# EAGLE design 104-de-8 (EAGLE 6.6.0)

## Sheet 1 of 2
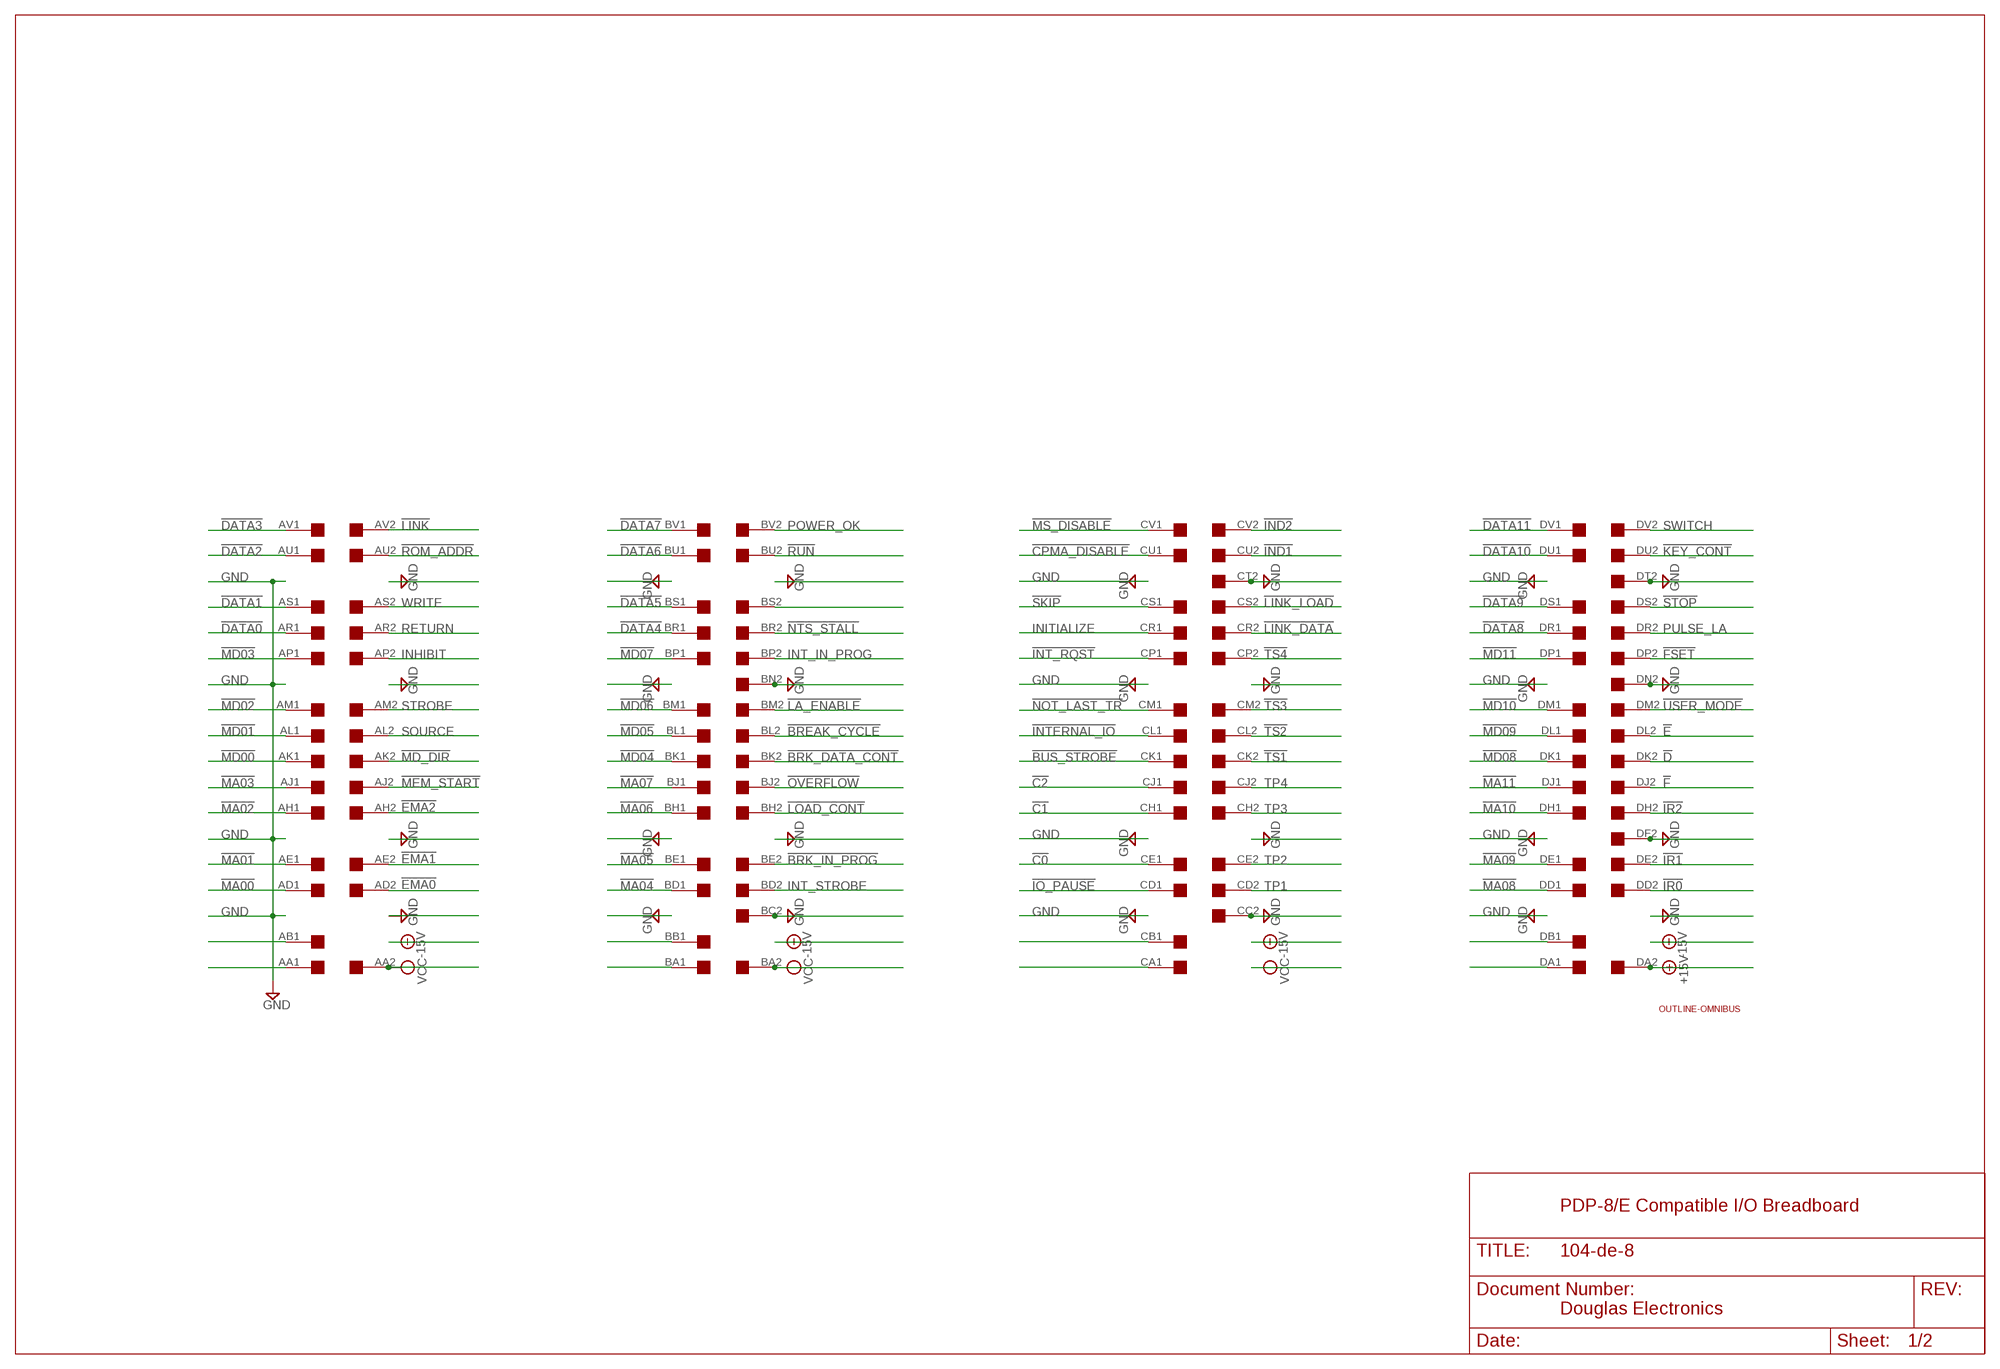
[diagram p0: schematic, sheet 1]

### Parts
U$1  OUTLINE-OMNIBUS  [OMNIBUS]
U$2  QUAD  [EDGE-CON8]

### Nets
!BREAK_CYCLE: U$2.BL2
!BRK_DATA_CONT: U$2.BK2
!BRK_IN_PROG: U$2.BE2
!BUS_STROBE: U$2.CK1
!C0: U$2.CE1
!C1: U$2.CH1
!C2: U$2.CJ1
!CPMA_DISABLE: U$2.CU1
!D: U$2.DK2
!DATA0: U$2.AR1
!DATA1: U$2.AS1
!DATA2: U$2.AU1
!DATA3: U$2.AV1
!DATA4: U$2.BR1
!DATA5: U$2.BS1
!DATA6: U$2.BU1
!DATA7: U$2.BV1
!DATA8: U$2.DR1
!DATA9: U$2.DS1
!DATA10: U$2.DU1
!DATA11: U$2.DV1
!E: U$2.DL2
!EMA0: U$2.AD2 ; also sheet 2
!EMA1: U$2.AE2 ; also sheet 2
!EMA2: U$2.AH2 ; also sheet 2
!F: U$2.DJ2
!FSET: U$2.DP2
!IND1: U$2.CU2
!IND2: U$2.CV2
!INT_RQST: U$2.CP1
!INTERNAL_IO: U$2.CL1
!IO_PAUSE: U$2.CD1
!IR0: U$2.DD2
!IR1: U$2.DE2
!IR2: U$2.DH2
!KEY_CONT: U$2.DU2
!LA_ENABLE: U$2.BM2
!LINK: U$2.AV2
!LINK_DATA: U$2.CR2
!LINK_LOAD: U$2.CS2
!LOAD_CONT: U$2.BH2
!MA00: U$2.AD1 ; also sheet 2
!MA01: U$2.AE1 ; also sheet 2
!MA02: U$2.AH1 ; also sheet 2
!MA03: U$2.AJ1 ; also sheet 2
!MA04: U$2.BD1 ; also sheet 2
!MA05: U$2.BE1 ; also sheet 2
!MA06: U$2.BH1 ; also sheet 2
!MA07: U$2.BJ1 ; also sheet 2
!MA08: U$2.DD1 ; also sheet 2
!MA09: U$2.DE1 ; also sheet 2
!MA10: U$2.DH1 ; also sheet 2
!MA11: U$2.DJ1 ; also sheet 2
!MD00: U$2.AK1
!MD01: U$2.AL1
!MD02: U$2.AM1
!MD03: U$2.AP1
!MD04: U$2.BK1
!MD05: U$2.BL1
!MD06: U$2.BM1
!MD07: U$2.BP1
!MD08: U$2.DK1
!MD09: U$2.DL1
!MD10: U$2.DM1
!MD11: U$2.DP1
!MD_DIR: U$2.AK2 ; also sheet 2
!MEM_START: U$2.AJ2
!MS_DISABLE: U$2.CV1
!NOT_LAST_TR: U$2.CM1
!NTS_STALL: U$2.BR2
!OVERFLOW: U$2.BJ2
!ROM_ADDR: U$2.AU2
!RUN: U$2.BU2
!SKIP: U$2.CS1
!STOP: U$2.DS2
!TS1: U$2.CK2
!TS2: U$2.CL2
!TS3: U$2.CM2
!TS4: U$2.CP2
!USER_MODE: U$2.DM2
+15V: U$2.DA2
GND [supply]: U$2.BC2 U$2.BN2 U$2.CC2 U$2.CT2 U$2.DF2 U$2.DN2 U$2.DT2 ; also sheet 2
INHIBIT: U$2.AP2
INITIALIZE: U$2.CR1
INT_IN_PROG: U$2.BP2
INT_STROBE: U$2.BD2
N$46: U$2.AB1
N$47: U$2.AA1
N$48: U$2.BB1
N$49: U$2.BA1
N$50: U$2.CA1
N$51: U$2.BS2
N$52: U$2.CB1
N$53: U$2.DA1
N$54: U$2.DB1
POWER_OK: U$2.BV2
PULSE_LA: U$2.DR2
RETURN: U$2.AR2
SOURCE: U$2.AL2
STROBE: U$2.AM2
SWITCH: U$2.DV2
TP1: U$2.CD2
TP2: U$2.CE2
TP3: U$2.CH2
TP4: U$2.CJ2
VCC [supply]: U$2.AA2 U$2.BA2 ; also sheet 2
WRITE: U$2.AS2
Unconnected: U$2.AB2 U$2.AC1 U$2.AC2 U$2.AF1 U$2.AF2 U$2.AN1 U$2.AN2 U$2.AT1 U$2.AT2 U$2.BB2 U$2.BC1 U$2.BF1 U$2.BF2 U$2.BN1 U$2.BT1 U$2.BT2 U$2.CA2 U$2.CB2 U$2.CC1 U$2.CF1 U$2.CF2 U$2.CN1 U$2.CN2 U$2.CT1 U$2.DB2 U$2.DC1 U$2.DC2 U$2.DF1 U$2.DN1 U$2.DT1

### Notes on the sheet
- PDP-8/E Compatible I/O Breadboard
- Douglas Electronics

## Sheet 2 of 2
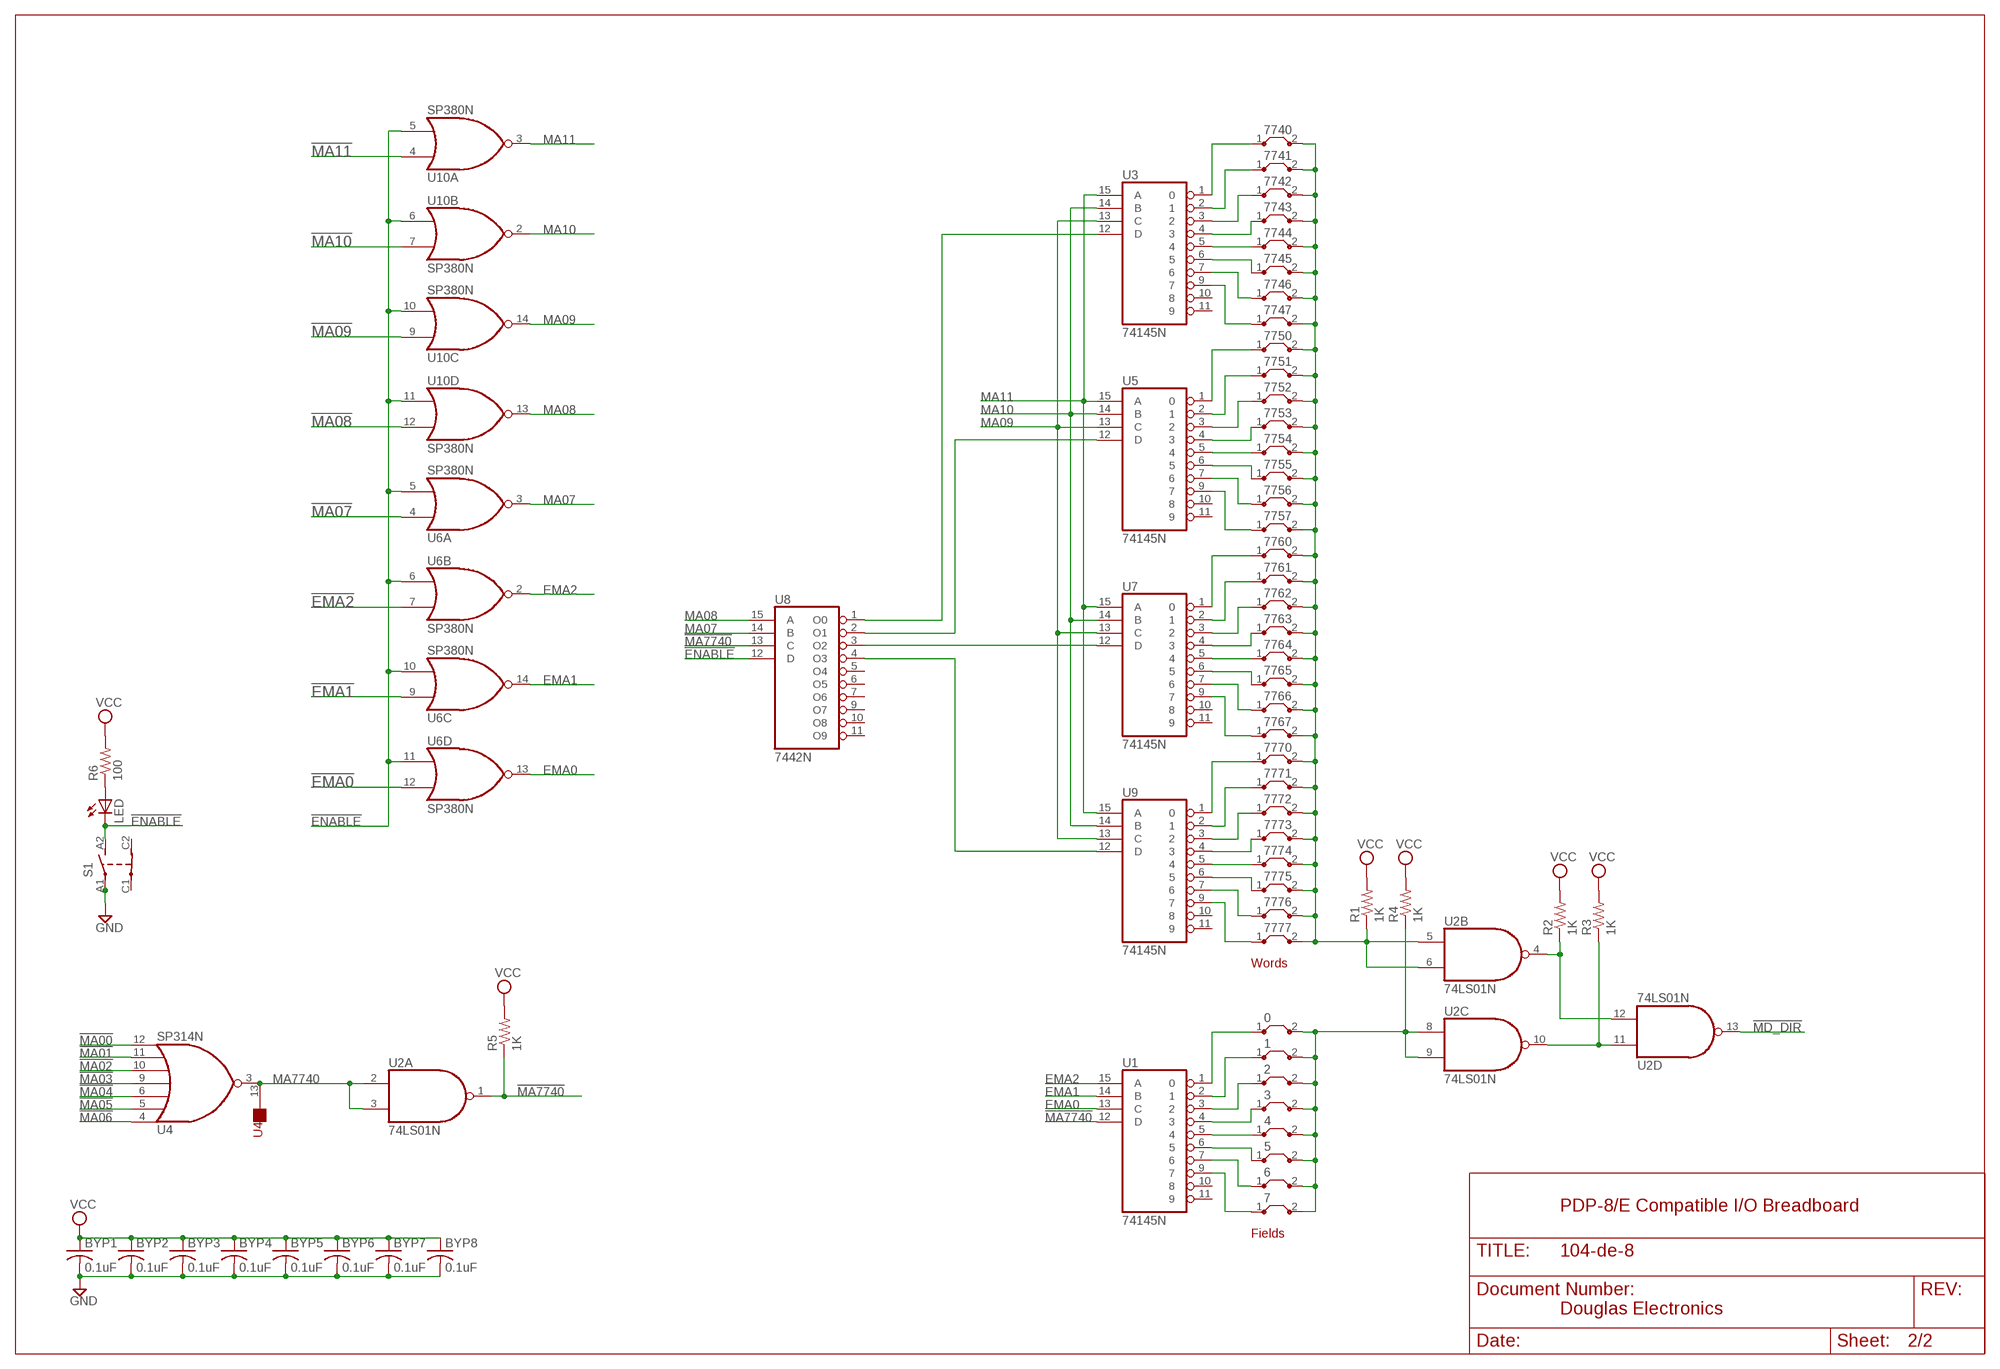
[diagram p1: schematic, sheet 2]

### Parts
0  J5MM  [05]
1  J5MM  [05]
2  J5MM  [05]
3  J5MM  [05]
4  J5MM  [05]
5  J5MM  [05]
6  J5MM  [05]
7  J5MM  [05]
7740  J5MM  [05]
7741  J5MM  [05]
7742  J5MM  [05]
7743  J5MM  [05]
7744  J5MM  [05]
7745  J5MM  [05]
7746  J5MM  [05]
7747  J5MM  [05]
7750  J5MM  [05]
7751  J5MM  [05]
7752  J5MM  [05]
7753  J5MM  [05]
7754  J5MM  [05]
7755  J5MM  [05]
7756  J5MM  [05]
7757  J5MM  [05]
7760  J5MM  [05]
7761  J5MM  [05]
7762  J5MM  [05]
7763  J5MM  [05]
7764  J5MM  [05]
7765  J5MM  [05]
7766  J5MM  [05]
7767  J5MM  [05]
7770  J5MM  [05]
7771  J5MM  [05]
7772  J5MM  [05]
7773  J5MM  [05]
7774  J5MM  [05]
7775  J5MM  [05]
7776  J5MM  [05]
7777  J5MM  [05]
BYP1  0.1uF  C-US  [C063-025X075]
BYP2  0.1uF  C-US  [C063-025X075]
BYP3  0.1uF  C-US  [C063-025X075]
BYP4  0.1uF  C-US  [C063-025X075]
BYP5  0.1uF  C-US  [C063-025X075]
BYP6  0.1uF  C-US  [C063-025X075]
BYP7  0.1uF  C-US  [C063-025X075]
BYP8  0.1uF  C-US  [C063-025X075]
LED  LED5MM  [LED5MM]
R1  1K  R-US_0207/10  [0207/10]
R2  1K  R-US_0207/10  [0207/10]
R3  1K  R-US_0207/10  [0207/10]
R4  1K  R-US_0207/10  [0207/10]
R5  1K  R-US_0207/10  [0207/10]
R6  100  R-US_0207/10  [0207/10]
S1  T8201  [T8000]
U1  74145N  [DIL16]
U2  74LS01N  [DIL14]
U3  74145N  [DIL16]
U4  SP314N  [DIL14]
U5  74145N  [DIL16]
U6  SP380N  [DIL14]
U7  74145N  [DIL16]
U8  7442N  74LS42N  [DIL16]
U9  74145N  [DIL16]
U10  SP380N  [DIL14]

### Nets
!EMA0: U6.12(D:I1) ; also sheet 1
!EMA1: U6.9(C:I0) ; also sheet 1
!EMA2: U6.7(B:I1) ; also sheet 1
!ENABLE: LED.K(C) S1.A2 U6.5(A:I1) U6.6(B:I0) U6.10(C:I1) U6.11(D:I0) U8.12(D) U10.5(A:I1) U10.6(B:I0) U10.10(C:I1) U10.11(D:I0)
!MA00: U4.12(I6) ; also sheet 1
!MA01: U4.11(I5) ; also sheet 1
!MA02: U4.10(I4) ; also sheet 1
!MA03: U4.9(I3) ; also sheet 1
!MA04: U4.6(I2) ; also sheet 1
!MA05: U4.5(I1) ; also sheet 1
!MA06: U4.4(I0) ; also sheet 1
!MA07: U6.4(A:I0) ; also sheet 1
!MA08: U10.12(D:I1) ; also sheet 1
!MA09: U10.9(C:I0) ; also sheet 1
!MA10: U10.7(B:I1) ; also sheet 1
!MA11: U10.4(A:I0) ; also sheet 1
!MA7740: R5.1 U1.12(D) U2.1(A:O) U8.13(C)
!MD_DIR: U2.13(D:O) ; also sheet 1
EMA0: U1.13(C) U6.13(D:O)
EMA1: U1.14(B) U6.14(C:O)
EMA2: U1.15(A) U6.2(B:O)
GND [supply]: BYP1.2 BYP2.2 BYP3.2 BYP4.2 BYP5.2 BYP6.2 BYP7.2 BYP8.2 S1.A1 ; also sheet 1
MA07: U6.3(A:O) U8.14(B)
MA08: U8.15(A) U10.13(D:O)
MA09: U3.13(C) U5.13(C) U7.13(C) U9.13(C) U10.14(C:O)
MA10: U3.14(B) U5.14(B) U7.14(B) U9.14(B) U10.2(B:O)
MA11: U3.15(A) U5.15(A) U7.15(A) U9.15(A) U10.3(A:O)
MA7740: U2.2(A:I0) U2.3(A:I1) U4.3(O) U4.13(NC)
N$2: LED.A R6.1
N$3: U8.4(O3) U9.12(D)
N$4: U5.12(D) U8.2(O1)
N$7: U7.12(D) U8.3(O2)
N$8: U3.12(D) U8.1(O0)
N$33: 7740.2 7741.2 7742.2 7743.2 7744.2 7745.2 7746.2 7747.2 7750.2 7751.2 7752.2 7753.2 7754.2 7755.2 7756.2 7757.2 7760.2 7761.2 7762.2 7763.2 7764.2 7765.2 7766.2 7767.2 7770.2 7771.2 7772.2 7773.2 7774.2 7775.2 7776.2 7777.2 R1.1 U2.5(B:I0) U2.6(B:I1)
N$34: R2.1 U2.4(B:O) U2.12(D:I1)
N$35: R3.1 U2.10(C:O) U2.11(D:I0)
N$36: 0.1 U1.1
N$38: 0.2 1.2 2.2 3.2 4.2 5.2 6.2 7.2 R4.1 U2.8(C:I0) U2.9(C:I1)
N$39: 1.1 U1.2
N$40: 2.1 U1.3
N$41: 3.1 U1.4
N$43: 4.1 U1.5
N$44: 6.1 U1.7
N$55: 7.1 U1.9
N$56: 5.1 U1.6
N$58: 7740.1 U3.1
N$59: 7741.1 U3.2
N$60: 7742.1 U3.3
N$61: 7743.1 U3.4
N$62: 7744.1 U3.5
N$63: 7745.1 U3.6
N$64: 7746.1 U3.7
N$65: 7747.1 U3.9
N$67: 7750.1 U5.1
N$68: 7751.1 U5.2
N$69: 7752.1 U5.3
N$70: 7753.1 U5.4
N$71: 7754.1 U5.5
N$72: 7755.1 U5.6
N$73: 7756.1 U5.7
N$74: 7757.1 U5.9
N$76: 7760.1 U7.1
N$77: 7761.1 U7.2
N$78: 7762.1 U7.3
N$79: 7763.1 U7.4
N$80: 7764.1 U7.5
N$81: 7765.1 U7.6
N$82: 7766.1 U7.7
N$83: 7767.1 U7.9
N$85: 7770.1 U9.1
N$86: 7771.1 U9.2
N$87: 7772.1 U9.3
N$88: 7773.1 U9.4
N$89: 7774.1 U9.5
N$90: 7775.1 U9.6
N$91: 7776.1 U9.7
N$92: 7777.1 U9.9
VCC [supply]: BYP1.1 BYP2.1 BYP3.1 BYP4.1 BYP5.1 BYP6.1 BYP7.1 BYP8.1 R1.2 R2.2 R3.2 R4.2 R5.2 R6.2 ; also sheet 1
Unconnected: S1.C1 S1.C2 U1.10 U1.11 U3.10 U3.11 U4.2(NC) U4.7(NC) U4.14(NC) U5.10 U5.11 U7.10 U7.11 U8.5(O4) U8.6(O5) U8.7(O6) U8.9(O7) U8.10(O8) U8.11(O9) U9.10 U9.11

### Notes on the sheet
- Words
- PDP-8/E Compatible I/O Breadboard
- Fields
- Douglas Electronics

## Power pins joined to a net without a drawn wire
GND: U1.8(GND) U2.7(P:GND) U3.8(GND) U4.1(GND) U5.8(GND) U6.1(P:GND) U7.8(GND) U8.8(GND) U9.8(GND) U10.1(P:GND)
VCC: U1.16(VCC) U2.14(P:VCC) U3.16(VCC) U4.8(VCC) U5.16(VCC) U6.8(P:VCC) U7.16(VCC) U8.16(VCC) U9.16(VCC) U10.8(P:VCC)

## Library data of the parts
0 1-7 7740-7747 7750-7757 7760-7767 7770-7777 = jumper:J: Bridge
BYP1-BYP8 = dec-con:C-US: Capacitors with funky DEC lead spacing.
LED = adafruit:LED: LED OSRAM: - CHIPLED LG R971, LG N971, LY N971, LG Q971, LY Q971, LO R971, LY R971 LH N974, LH R974 LS Q976, LO Q976, LY Q976 LO Q996 - Hyper CHIPLED LW Q18S LB Q993, LB Q99A, LB R99A - SideLED LS A670, LO A670, LY A670, LG A670, LP A670 LB A673, LV A673, LT A673, LW A673 LH A674 LY A675 LS A676, LA A676, LO A676, LY A676, LW A676 LS A679, LY A679, LG A679 - Hyper Micro SIDELED® LS Y876, LA Y876, LO Y876, LY Y876 LT Y87S - SmartLED LW L88C, LW L88S LB L89C, LB L89S, LG L890 LS L89K, LO L89K, LY L89K LS L896, LA L896, LO L896, LY L896 - TOPLED LS T670, LO T670, LY T670, LG T670, LP T670 LSG T670, LSP T670, LSY T670, LOP T670, LYG T670 LG T671, LOG T671, LSG T671 LB T673, LV T673, LT T673, LW T673 LH T674 LS T676, LA T676, LO T676, LY T676, LB T676, LH T676, LSB T676, LW T676 LB T67C, LV T67C, LT T67C, LS T67K, LO T67K, LY T67K, LW E67C LS E67B, LA E67B, LO E67B, LY E67B, LB E67C, LV E67C, LT E67C LW T67C LS T679, LY T679, LG T679 LS T770, LO T770, LY T770, LG T770, LP T770 LB T773, LV T773, LT T773, LW T773 LH T774 LS E675, LA E675, LY E675, LS T675 LS T776, LA T776, LO T776, LY T776, LB T776 LHGB T686 LT T68C, LB T68C - Hyper Mini TOPLED® LB M676 - Mini TOPLED Santana® LG M470 LS M47K, LO M47K, LY M47K Source: http://www.osram.convergy.de/
R1-R6 = rcl:R-US_: RESISTOR, American symbol
S1 = dec-con:T8201: T8201 DPST Switch (Electroswitch)
U1 U3 U5 U7 U9 = 74xx-us:74*145: BCD to decimal DECODER/DRIVER
U2 = 74xx-us:74*01: Quad 2-input NAND gate, open collector
U4 = dec-con:SP314: 7-Input NOR gate
U6 U10 = dec-con:SP380: Quad NOR gate (use 8640)
U8 = 74xx-us:74*42: 4-line to 10-line DECODER (1-of-10)
U$1 = dec-con:OUTLINE-*: Board outlines for DEC boards.
U$2 = dec-con:QUAD: Quad-Height DEC board

## Net classes
0 default: width 0.813 mm
1 supply: width 0.813 mm

## Board
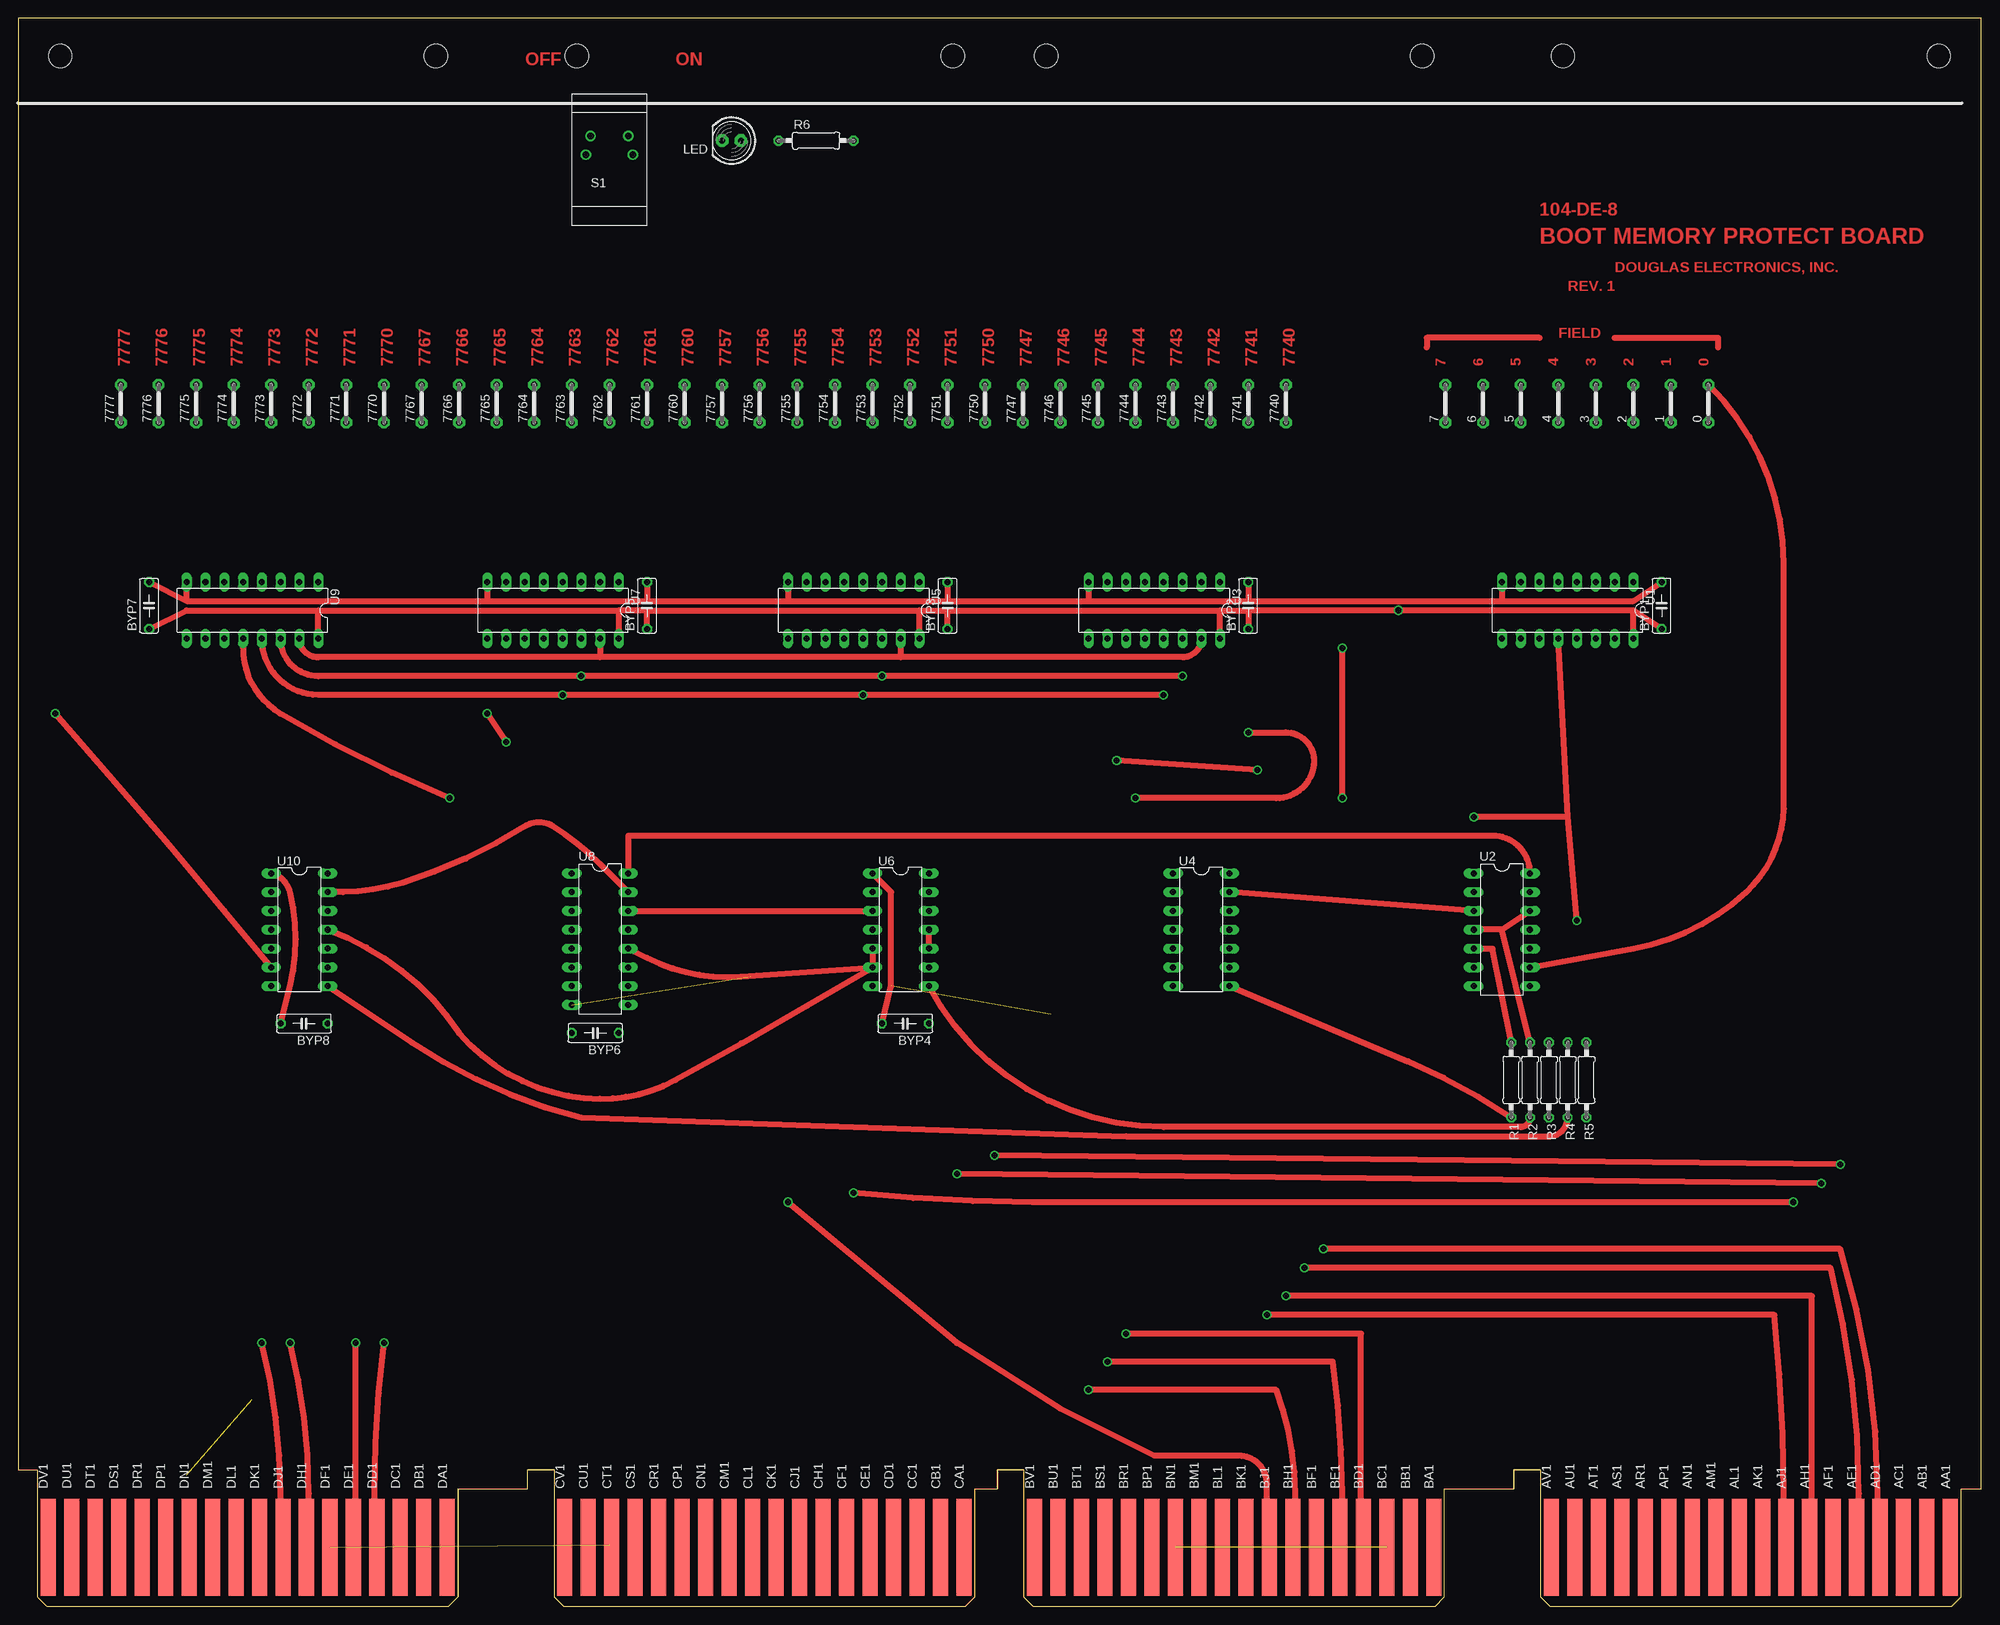
[diagram p2: board, top side]
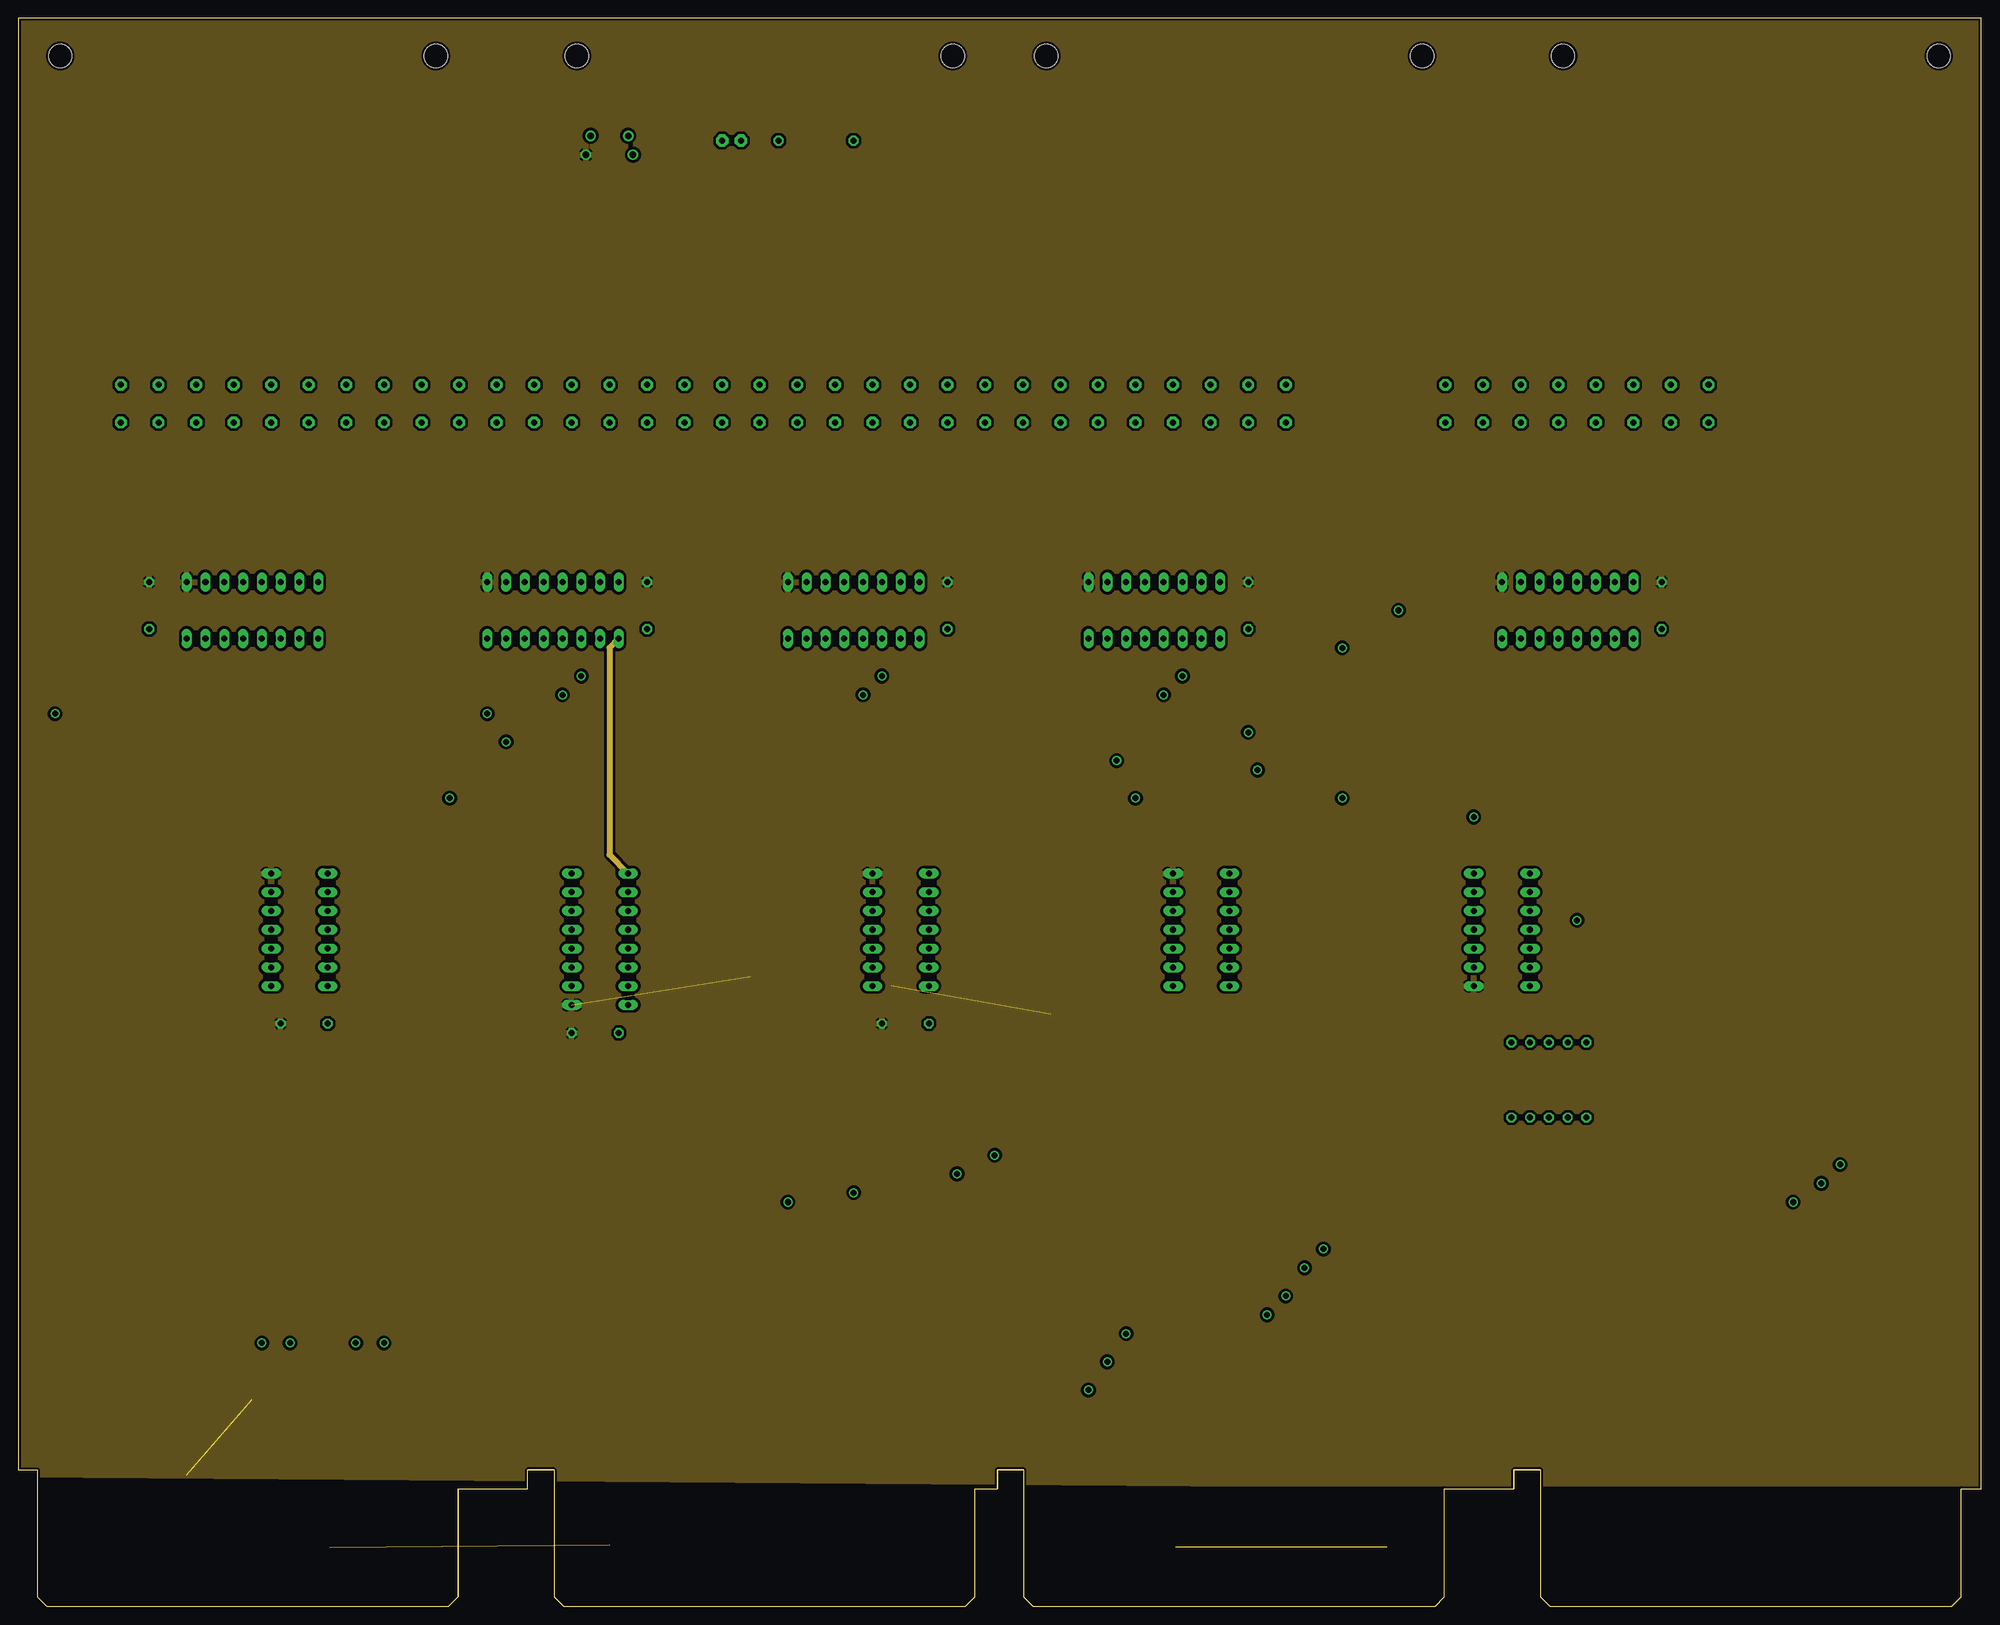
[diagram p3: board, inner layer PWR]
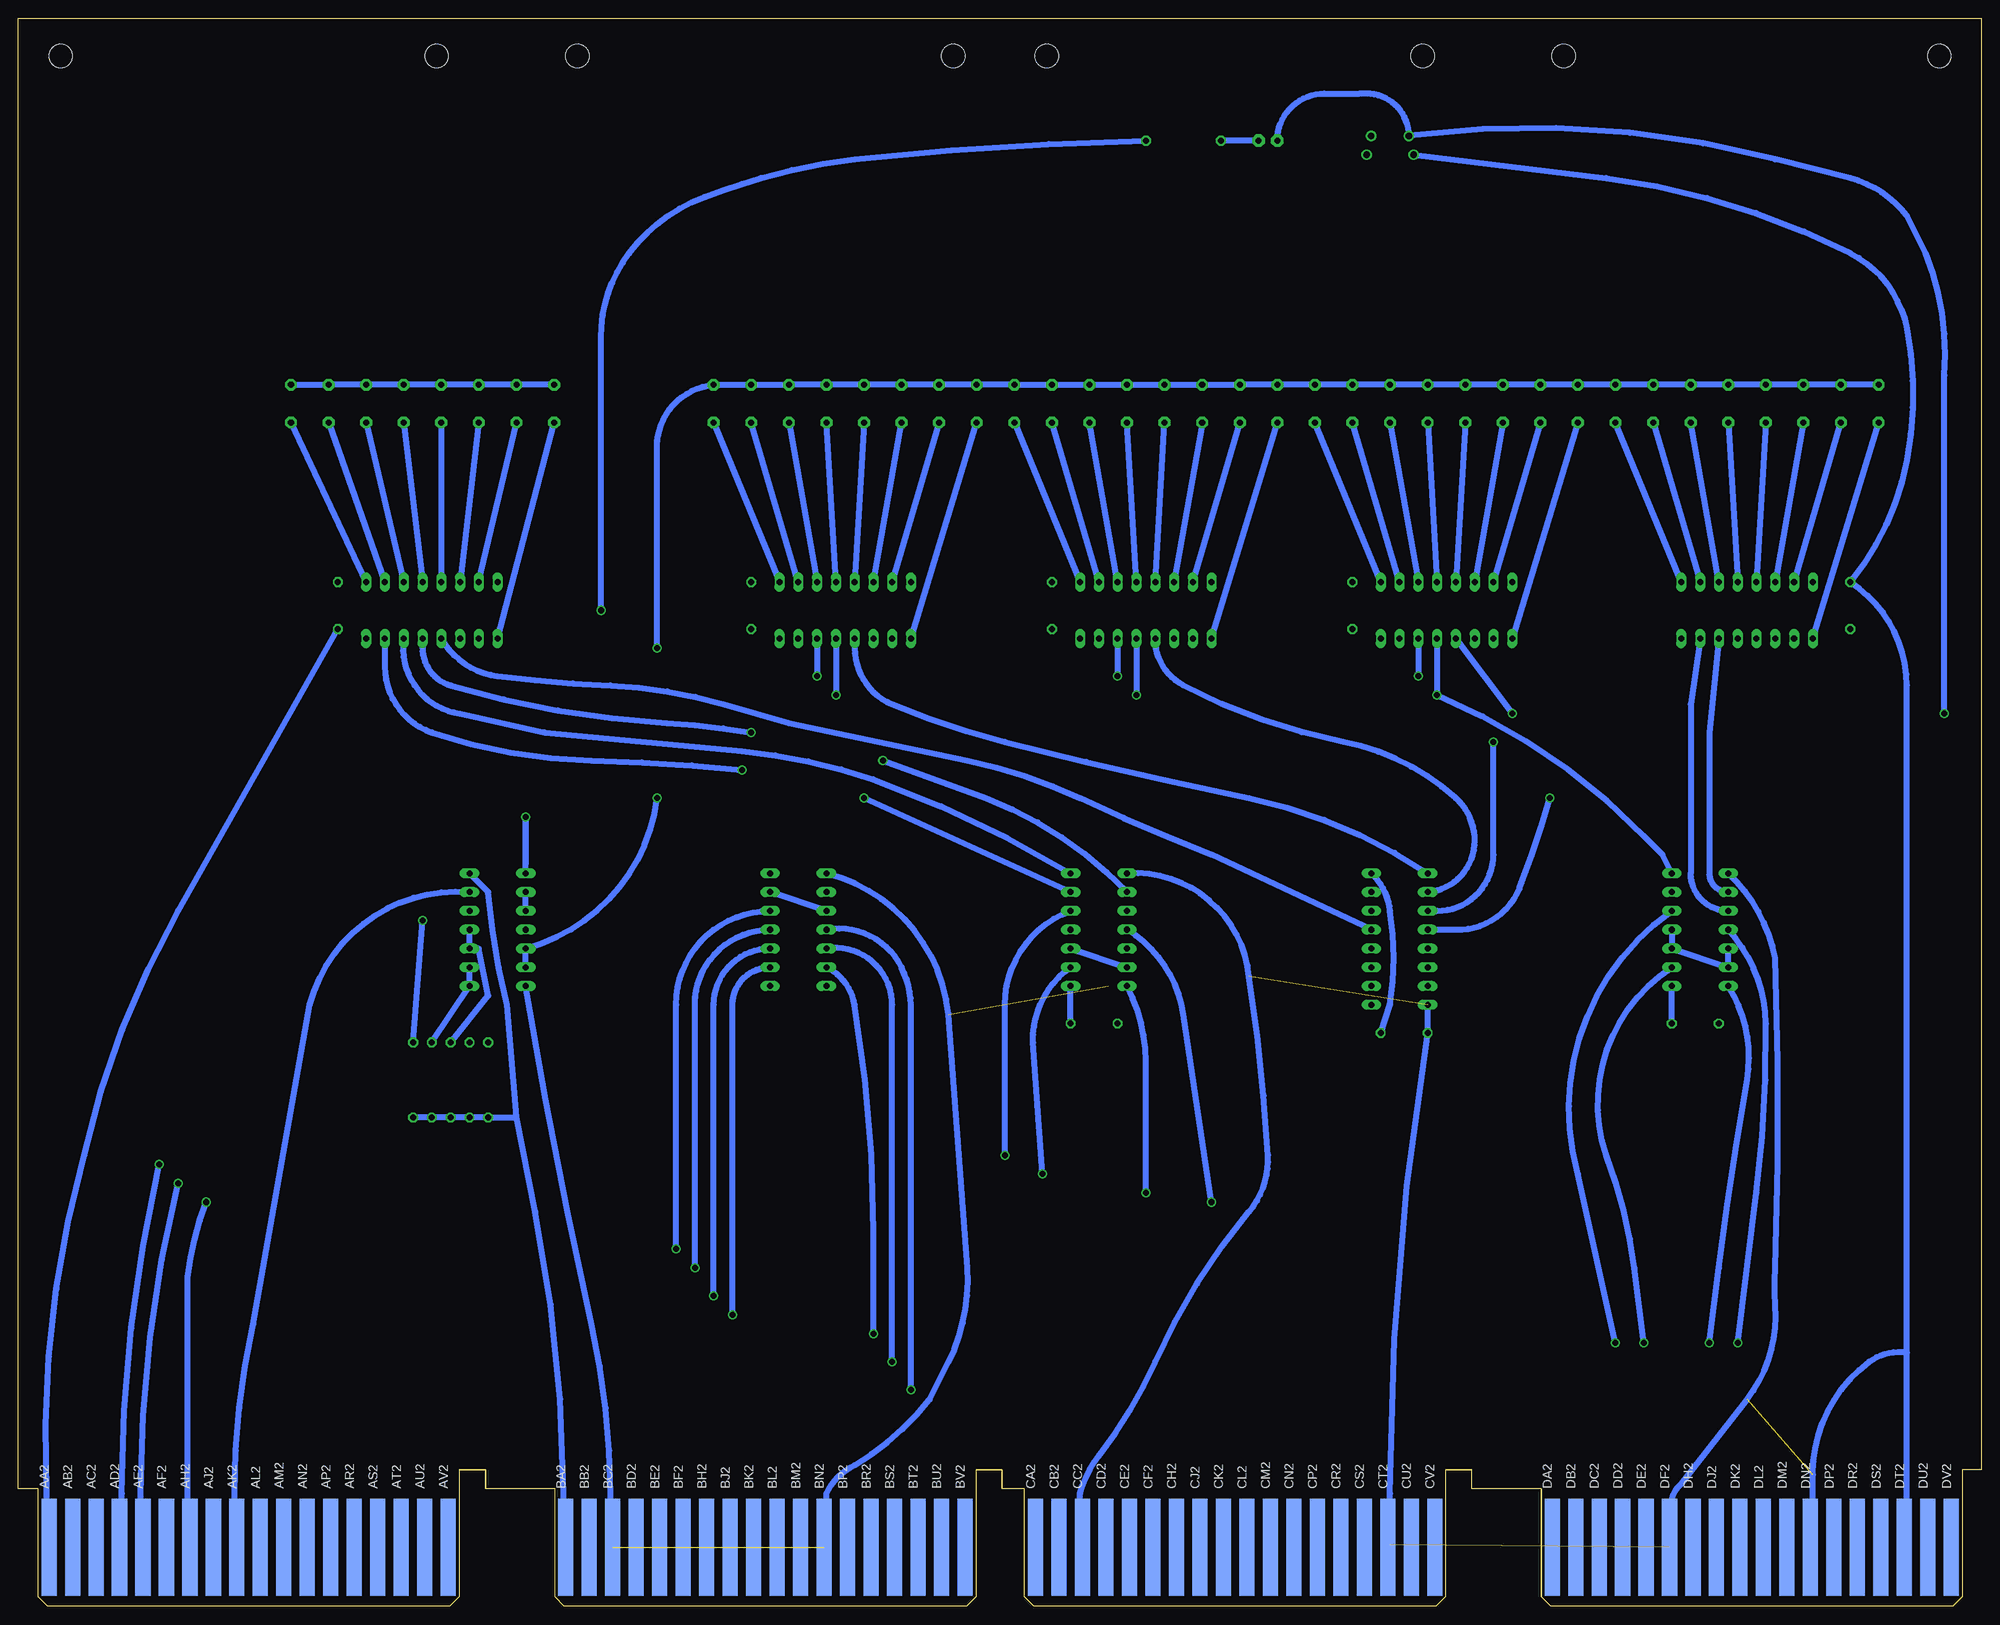
[diagram p4: board, bottom side, seen from below]

Size 265.3 x 214.63 mm. Coordinates in mm from the lower left corner, seen from the top.
Copper layers (1+2+16): Top 0.035mm / dielectric 1.5mm / PWR 0.035mm / dielectric 0.15mm / Bottom 0.035mm
Design rules "16mils *": minimum track width 16mil, minimum drill 32mil, track to track 15mil, track to pad 10mil, pad to pad 10mil, via to via 10mil, smd to smd 10mil, copper to edge 13mil, drill to drill 10mil, minimum pad ring 10mil, minimum via ring 8mil, stop-mask expansion 0mil, vias tented up to drill 0mil, thermal gap 10mil

### Footprints (pad centres in the part's own frame; a part is rotated, then mirrored left to right if it is on the bottom)
05 = drill 0.813 pad 1.6 octagon: 1 -2.54,0; 2 2.54,0
C063-025X075 = drill 0.813 octagon: 1 -2.54,0; 2 3.81,0
LED5MM = drill 0.813 pad 1.676 octagon: A -1.27,0; K 1.27,0
0207/10 = drill 0.813 octagon: 1 -5.08,0; 2 5.08,0
T8000 = drill 0.9: A1 -3.175,1.905; A2 -2.54,4.445; C1 3.175,1.905; C2 2.54,4.445
DIL16 = drill 0.813 long: 1 -8.89,-3.81; 2 -6.35,-3.81; 3 -3.81,-3.81; 4 -1.27,-3.81; 5 1.27,-3.81; 6 3.81,-3.81; 7 6.35,-3.81; 8 8.89,-3.81; 9 8.89,3.81; 10 6.35,3.81; 11 3.81,3.81; 12 1.27,3.81; 13 -1.27,3.81; 14 -3.81,3.81; 15 -6.35,3.81; 16 -8.89,3.81
DIL14 = drill 0.813 long: 1 -7.62,-3.81; 2 -5.08,-3.81; 3 -2.54,-3.81; 4 0,-3.81; 5 2.54,-3.81; 6 5.08,-3.81; 7 7.62,-3.81; 8 7.62,3.81; 9 5.08,3.81; 10 2.54,3.81; 11 0,3.81; 12 -2.54,3.81; 13 -5.08,3.81; 14 -7.62,3.81
OMNIBUS = hole 3.175: 208.915,209.55; 259.715,209.55; 189.865,209.55; 139.065,209.55; 75.616,209.55; 126.416,209.55; 56.566,209.55; 5.766,209.55
EDGE-CON8 = smd 2.032 x 13.106: AA1 261.303,7.938; AB1 258.127,7.938; AC1 254.952,7.938; AD1 251.778,7.938; AE1 248.602,7.938; AF1 245.428,7.938; AH1 242.252,7.938; AJ1 239.077,7.938; AK1 235.903,7.938; AL1 232.727,7.938; AM1 229.553,7.938; AN1 226.377,7.938; AP1 223.202,7.938; AR1 220.028,7.938; AS1 216.852,7.938; AT1 213.678,7.938; AU1 210.502,7.938; AV1 207.327,7.938; BA1 191.452,7.938; BB1 188.278,7.938; BC1 185.102,7.938; BD1 181.928,7.938; BE1 178.752,7.938; BF1 175.577,7.938; BH1 172.403,7.938; BJ1 169.227,7.938; BK1 166.053,7.938; BL1 162.877,7.938; BM1 159.702,7.938; BN1 156.528,7.938; BP1 153.352,7.938; BR1 150.178,7.938; BS1 147.002,7.938; BT1 143.827,7.938; BU1 140.653,7.938; BV1 137.477,7.938; CA1 127.953,7.938; CB1 124.778,7.938; CC1 121.603,7.938; CD1 118.427,7.938; CE1 115.252,7.938; CF1 112.078,7.938; CH1 108.903,7.938; CJ1 105.728,7.938; CK1 102.552,7.938; CL1 99.377,7.938; CM1 96.203,7.938; CN1 93.028,7.938; CP1 89.853,7.938; CR1 86.677,7.938; CS1 83.502,7.938; CT1 80.328,7.938; CU1 77.153,7.938; CV1 73.978,7.938; DA1 58.102,7.938; DB1 54.928,7.938; DC1 51.752,7.938; DD1 48.578,7.938; DE1 45.403,7.938; DF1 42.227,7.938; DH1 39.053,7.938; DJ1 35.877,7.938; DK1 32.703,7.938; DL1 29.527,7.938; DM1 26.352,7.938; DN1 23.177,7.938; DP1 20.003,7.938; DR1 16.828,7.938; DS1 13.652,7.938; DT1 10.477,7.938; DU1 7.303,7.938; DV1 4.128,7.938 | smd 2.032 x 13.106 bottom: AA2 261.303,7.938; AB2 258.127,7.938; AC2 254.952,7.938; AD2 251.778,7.938; AE2 248.602,7.938; AF2 245.428,7.938; AH2 242.252,7.938; AJ2 239.077,7.938; AK2 235.903,7.938; AL2 232.727,7.938; AM2 229.553,7.938; AN2 226.377,7.938; AP2 223.202,7.938; AR2 220.028,7.938; AS2 216.852,7.938; AT2 213.678,7.938; AU2 210.502,7.938; AV2 207.327,7.938; BA2 191.452,7.938; BB2 188.278,7.938; BC2 185.102,7.938; BD2 181.928,7.938; BE2 178.752,7.938; BF2 175.577,7.938; BH2 172.403,7.938; BJ2 169.227,7.938; BK2 166.053,7.938; BL2 162.877,7.938; BM2 159.702,7.938; BN2 156.528,7.938; BP2 153.352,7.938; BR2 150.178,7.938; BS2 147.002,7.938; BT2 143.827,7.938; BU2 140.653,7.938; BV2 137.477,7.938; CA2 127.953,7.938; CB2 124.778,7.938; CC2 121.603,7.938; CD2 118.427,7.938; CE2 115.252,7.938; CF2 112.078,7.938; CH2 108.903,7.938; CJ2 105.728,7.938; CK2 102.552,7.938; CL2 99.377,7.938; CM2 96.203,7.938; CN2 93.028,7.938; CP2 89.853,7.938; CR2 86.677,7.938; CS2 83.502,7.938; CT2 80.328,7.938; CU2 77.153,7.938; CV2 73.978,7.938; DA2 58.102,7.938; DB2 54.928,7.938; DC2 51.752,7.938; DD2 48.578,7.938; DE2 45.403,7.938; DF2 42.227,7.938; DH2 39.053,7.938; DJ2 35.877,7.938; DK2 32.703,7.938; DL2 29.527,7.938; DM2 26.352,7.938; DN2 23.177,7.938; DP2 20.003,7.938; DR2 16.828,7.938; DS2 13.652,7.938; DT2 10.477,7.938; DU2 7.303,7.938; DV2 4.128,7.938

### Placement (x,y rotation side)
0  228.47,162.56 90 top
1  223.39,162.56 90 top
2  218.31,162.56 90 top
3  213.23,162.56 90 top
4  208.15,162.56 90 top
5  203.07,162.56 90 top
6  197.99,162.56 90 top
7  192.91,162.56 90 top
7740  171.32,162.56 90 top
7741  166.24,162.56 90 top
7742  161.16,162.56 90 top
7743  156.08,162.56 90 top
7744  151,162.56 90 top
7745  145.92,162.56 90 top
7746  140.84,162.56 90 top
7747  135.76,162.56 90 top
7750  130.68,162.56 90 top
7751  125.6,162.56 90 top
7752  120.52,162.56 90 top
7753  115.44,162.56 90 top
7754  110.36,162.56 90 top
7755  105.28,162.56 90 top
7756  100.2,162.56 90 top
7757  95.12,162.56 90 top
7760  90.04,162.56 90 top
7761  84.96,162.56 90 top
7762  79.88,162.56 90 top
7763  74.8,162.56 90 top
7764  69.72,162.56 90 top
7765  64.64,162.56 90 top
7766  59.56,162.56 90 top
7767  54.48,162.56 90 top
7770  49.4,162.56 90 top
7771  44.32,162.56 90 top
7772  39.24,162.56 90 top
7773  34.16,162.56 90 top
7774  29.08,162.56 90 top
7775  24,162.56 90 top
7776  18.92,162.56 90 top
7777  13.84,162.56 90 top
BYP1  222.12,134.62 90 top
BYP2  166.24,134.62 90 top
BYP3  125.6,134.62 90 top
BYP4  120.52,78.74 180 top
BYP5  84.96,134.62 90 top
BYP6  78.61,77.47 180 top
BYP7  17.65,134.62 90 top
BYP8  39.24,78.74 180 top
LED  96.39,198.12 180 top
R1  201.8,71.12 270 top
R2  204.34,71.12 270 top
R3  206.88,71.12 270 top
R4  209.42,71.12 270 top
R5  211.96,71.12 270 top
R6  107.82,198.12 0 top
S1  79.88,194.31 0 top
U1  209.42,134.62 180 top
U2  200.53,91.44 270 top
U3  153.54,134.62 180 top
U4  159.89,91.44 270 top
U5  112.9,134.62 180 top
U6  119.25,91.44 270 top
U7  72.26,134.62 180 top
U8  78.61,90.17 270 top
U9  31.62,134.62 180 top
U10  37.97,91.44 270 top
U$1  -0.13,0 0 top
U$2  -0.13,0 0 top

### Tracks (layer width: path | path; a pad name or v marks a point on that pad's centre or on a via)
!EMA0  (via drill 0.81)
  Top 0.813: v246.25,59.69 v131.95,60.96
  Bottom 0.813: U$2.AD2 251.33,8.26 251.33,15.24 arc13 v246.25,59.69 | v131.95,60.96 131.95,81.28 arc70 U6.12
!EMA1  (via drill 0.81)
  Top 0.813: v243.71,57.15 v126.87,58.42
  Bottom 0.813: U$2.AE2 248.79,8.26 248.79,15.24 arc14 v243.71,57.15 | v126.87,58.42 128.14,76.2 arc57 U6.9
!EMA2  (via drill 0.81)
  Top 0.813: v239.9,54.61 137.03,54.61 arc-6 v112.9,55.88
  Bottom 0.813: U$2.AH2 242.44,8.26 242.44,44.45 arc14 v239.9,54.61 | v112.9,55.88 112.9,73.66 arc-28 U6.7
!ENABLE  (via drill 0.81)
  Top 0.813: U6.5 U6.6 | U6.10 U6.11 | U10.11 arc-37 59.56,77.47 arc49 78.61,68.58 arc29 88.77,71.12 arc2 U6.6 | U8.12 84.96,87.63 arc31 97.66,85.09 U6.6 | U10.6 27.81,93.98 arc2 v4.95,120.65
  Bottom 0.813: LED.K arc90 88.77,204.47 84.01,204.47 84,204.47 83.06,204.47 arc90 S1.A2 | U6.10 U6.6 | U10.5 U10.6 U10.10 U10.11 | v4.95,120.65 4.95,166.37 arc-26 7.49,182.88 10.03,187.96 arc-37 17.65,193.04 27.81,195.58 arc-22 S1.A2 | 77.34,198.73 S1.A2
!MA00  (via drill 0.81)
  Top 0.813: U$2.AD1 251.33,8.26 251.33,15.24 arc17 246.25,48.26 v176.4,48.26
  Bottom 0.813: v176.4,48.26 176.4,81.28 arc90 U4.12
!MA01  (via drill 0.81)
  Top 0.813: U$2.AE1 248.79,8.26 248.79,15.24 arc14 244.98,45.72 v173.86,45.72
  Bottom 0.813: v173.86,45.72 173.86,81.28 arc90 U4.11
!MA02  (via drill 0.81)
  Top 0.813: U$2.AH1 242.44,8.26 242.44,41.91 v171.32,41.91
  Bottom 0.813: v171.32,41.91 171.32,81.28 arc90 U4.10
!MA03  (via drill 0.81)
  Top 0.813: U$2.AJ1 238.63,8.26 238.63,15.24 arc6 237.36,39.37 v168.78,39.37
  Bottom 0.813: v168.78,39.37 168.78,81.28 arc90 U4.9
!MA04  (via drill 0.81)
  Top 0.813: U$2.BD1 181.48,8.26 181.48,36.83 v149.73,36.83
  Bottom 0.813: v149.73,36.83 149.73,50.8 arc-10 152.27,81.28 arc-55 U4.6
!MA05  (via drill 0.81)
  Top 0.813: U$2.BE1 178.94,8.26 178.94,15.24 arc8 177.67,33.02 v147.19,33.02
  Bottom 0.813: v147.19,33.02 147.19,81.28 arc-99 U4.5
!MA06  (via drill 0.81)
  Top 0.813: U$2.BH1 172.59,8.26 172.59,15.24 arc21 170.05,29.21 v144.65,29.21
  Bottom 0.813: v144.65,29.21 144.65,81.28 arc-25 145.92,86.36 arc-74 U4.4
!MA07  (via drill 0.81)
  Top 0.813: U$2.BJ1 168.78,8.26 168.78,16.51 arc90 164.97,20.32 153.54,20.32 140.84,26.67 126.87,35.56 v104.01,54.61
  Bottom 0.813: v104.01,54.61 107.82,80.01 arc-50 U6.4
!MA08  (via drill 0.81)
  Top 0.813: U$2.DD1 48.13,8.26 48.13,15.24 arc-7 v49.4,35.56
  Bottom 0.813: v49.4,35.56 54.48,58.42 arc71 U10.12
!MA09  (via drill 0.81)
  Top 0.813: U$2.DE1 45.59,8.26 v45.59,35.56
  Bottom 0.813: v45.59,35.56 46.86,45.72 arc-14 50.67,60.96 arc75 U10.9
!MA10  (via drill 0.81)
  Top 0.813: U$2.DH1 39.24,8.26 39.24,15.24 arc14 v36.7,35.56
  Bottom 0.813: v36.7,35.56 35.43,45.72 arc3 31.62,71.12 arc-42 U10.7
!MA11  (via drill 0.81)
  Top 0.813: U$2.DJ1 35.43,8.26 35.43,15.24 arc14 v32.89,35.56
  Bottom 0.813: v32.89,35.56 30.35,55.88 arc-8 29.08,78.74 arc-42 U10.4
!MA7740  (via drill 0.81)
  Top 0.813: v210.69,92.71 209.42,106.68 | 209.42,106.68 v196.72,106.68 | 209.42,106.68 U1.12
  Bottom 0.813: R5.1 v210.69,92.71 | U2.1 v196.72,106.68 196.72,100.33 | U1.12 arc-53 200.53,125.73 arc-5 185.29,124.46 arc14 170.05,121.92 161.16,119.38 137.03,114.3 arc13 121.79,109.22 arc-4 104.01,101.6 U8.13
!MD_DIR
  Bottom 0.813: U$2.AK2 236.09,8.26 236.09,15.24 arc13 233.55,38.1 225.93,81.28 arc80 U2.13
EMA0  (via drill 0.81)
  Top 0.813: v166.24,118.11 171.32,118.11 arc-90 175.13,114.3 arc-90 170.05,109.22 v151,109.22
  Bottom 0.813: U1.13 210.69,129.54 arc-74 206.88,124.46 arc-13 177.67,119.38 arc6 v166.24,118.11 | U6.13 v151,109.22
EMA1
  Bottom 0.813: U1.14 arc-90 205.61,120.65 194.18,118.11 167.51,115.57 arc13 149.73,111.76 arc11 U6.14
EMA2  (via drill 0.81)
  Top 0.813: v167.51,113.03 v148.46,114.3
  Bottom 0.813: U1.15 215.77,127 arc-71 209.42,118.11 arc-18 187.83,114.3 arc5 v167.51,113.03 | v148.46,114.3 134.49,109.22 arc26 U6.2
GND  (5 unrouted)
  Top 0.813: 22.73,135.89 63.37,135.89 | BYP7.2 22.73,135.89 | 22.73,135.89 U9.8 | U5.8 104.01,135.89 | 104.01,135.89 125.6,135.89 | 125.6,135.89 144.65,135.89 | 144.65,135.89 166.24,135.89 | 166.24,135.89 200.53,135.89 | 200.53,135.89 218.31,135.89 BYP1.2 | U1.8 200.53,135.89 | BYP2.2 166.24,135.89 | U3.8 144.65,135.89 | BYP3.2 125.6,135.89 | BYP5.2 84.96,135.89 | 84.96,135.89 104.01,135.89 | U7.8 63.37,135.89 | 63.37,135.89 84.96,135.89 | BYP4.2 117.98,83.82 117.98,96.52 U6.1 | BYP8.2 36.7,83.82 arc28 36.7,96.52 arc62 U10.1
  Bottom 0.813: S1.A1 50.67,193.04 arc20 17.65,182.88 arc52 10.03,172.72 arc22 10.03,154.94 arc28 BYP7.2 arc57 10.03,124.46 10.03,34.29 | U$2.BC2 185.29,8.26 185.29,15.24 arc-13 187.83,38.1 arc3 U2.7 | U$2.DT2 10.03,8.26 10.03,34.29 | U$2.DN2 22.73,8.26 22.73,17.78 arc53 15.11,33.02 arc46 10.03,34.29 | U$2.DF2 41.78,8.26 41.78,13.97 arc53 40.51,16.51 31.62,27.94 arc-42 27.81,40.64 arc9 27.81,45.72 arc-4 27.81,87.63 arc-36 U10.1 | U$2.CT2 79.88,8.26 79.88,15.24 arc9 BYP6.2 U8.8 | U$2.CC2 121.79,8.26 121.79,15.24 arc23 119.25,20.32 arc-14 111.63,33.02 arc16 98.93,53.34 arc-43 96.39,60.96 arc-5 98.93,85.09 arc-88 U6.1 | U$2.BN2 156.08,8.26 156.08,15.24 arc37 152.27,19.05 arc-21 142.11,27.94 139.57,33.02 arc-31 137.03,45.72 139.57,80.01 arc-69 U4.1
  pour PWR: -0.13,19.05 -0.13,214.63 266.57,215.9 265.3,16.51 158.62,16.51 -0.13,17.78
MA07
  Top 0.813: U8.14 U6.3
MA08
  Top 0.813: U8.15 78.61,100.33 arc13 72.26,105.41 arc65 68.45,105.41 arc-15 51.94,97.79 arc-18 U10.13
MA09  (via drill 0.81)
  Top 0.813: v154.81,123.19 v114.17,123.19 v73.53,123.19 40.51,123.19 arc-90 U9.13
  Bottom 0.813: U10.14 43.05,101.6 45.59,104.14 arc-23 v73.53,123.19 U7.13 | U3.13 v154.81,123.19 | U5.13 v114.17,123.19
MA10  (via drill 0.81)
  Top 0.813: v157.35,125.73 v116.71,125.73 v76.07,125.73 40.51,125.73 arc-90 U9.14
  Bottom 0.813: U3.14 v157.35,125.73 | U7.14 v76.07,125.73 | U5.14 v116.71,125.73 | U9.14 36.7,118.11 36.7,99.06 arc-90 U10.2
MA11
  Top 0.813: U3.15 arc-90 157.35,128.27 119.25,128.27 | 119.25,128.27 78.61,128.27 | 78.61,128.27 40.51,128.27 arc-90 U9.15 | U7.15 78.61,128.27 | U5.15 119.25,128.27
  Bottom 0.813: U9.15 39.24,121.92 39.24,99.06 arc-90 U10.3
MA7740
  Top 0.813: U2.3 U4.13
  Bottom 0.813: U2.3 U2.2 | U4.3 U4.13
N$1
  Top 0.813: 205.61,171.45 190.37,171.45 190.37,170.18
N$2
  Bottom 0.813: LED.A R6.1
N$3  (via drill 0.81)
  Top 0.813: U9.12 30.35,129.54 arc59 35.43,120.65 arc8 v58.29,109.22
  Bottom 0.813: U8.4 70.99,91.44 arc-74 62.1,97.79 arc-4 v58.29,109.22
N$4
  Bottom 0.813: U8.2 arc-90 68.45,104.14 arc-43 70.99,109.22 arc-31 86.23,116.84 arc17 107.82,124.46 arc62 U5.12
N$5
  Top 0.813: 215.77,171.45 229.74,171.45 229.74,170.18
N$7  (via drill 0.81)
  Top 0.813: v63.37,120.65 v65.91,116.84
  Bottom 0.813: U8.3 73.53,93.98 arc-90 65.91,101.6 v65.91,116.84 | U7.12 v63.37,120.65
N$8
  Bottom 0.813: U3.12 152.27,129.54 arc-67 147.19,121.92 arc-8 131.95,116.84 arc-3 98.93,109.22 arc22 U8.1
N$33  (via drill 0.81)
  Top 0.813: R1.1 199.26,88.9 U2.5 | v178.94,109.22 v178.94,129.54
  Bottom 0.813: U2.6 U2.5 arc-67 v178.94,109.22 | v178.94,129.54 178.94,157.48 arc80 7740.2 7741.2 7742.2 7743.2 7744.2 7745.2 7746.2 7747.2 7750.2 7751.2 7752.2 7753.2 7754.2 7755.2 7756.2 7757.2 7760.2 7761.2 7762.2 7763.2 7764.2 7765.2 7766.2 7767.2 7770.2 7771.2 7772.2 7773.2 7774.2 7775.2 7776.2 7777.2
N$34
  Top 0.813: R2.1 200.53,91.44 | 200.53,91.44 U2.4 | 200.53,91.44 U2.12
N$35
  Bottom 0.813: U2.11 U2.10 203.07,88.9 201.8,82.55 R3.1
N$36
  Bottom 0.813: 0.1 U1.1
N$38
  Top 0.813: U2.9 218.31,88.9 arc33 233.55,96.52 arc51 238.63,109.22 238.63,140.97 arc46 0.2
  Bottom 0.813: U2.9 U2.8 R4.1 | 0.2 1.2 2.2 3.2 4.2 5.2 6.2 7.2
N$39
  Bottom 0.813: 1.1 U1.2
N$40
  Bottom 0.813: 2.1 U1.3
N$41
  Bottom 0.813: 3.1 U1.4
N$43
  Bottom 0.813: 4.1 U1.5
N$44
  Bottom 0.813: U1.7 6.1
N$55
  Bottom 0.813: U1.9 7.1
N$56
  Bottom 0.813: 5.1 U1.6
N$58
  Bottom 0.813: 7740.1 U3.1
N$59
  Bottom 0.813: U3.2 7741.1
N$60
  Bottom 0.813: 7742.1 U3.3
N$61
  Bottom 0.813: U3.4 7743.1
N$62
  Bottom 0.813: 7744.1 U3.5
N$63
  Bottom 0.813: U3.6 7745.1
N$64
  Bottom 0.813: 7746.1 U3.7
N$65
  Bottom 0.813: U3.9 7747.1
N$67
  Bottom 0.813: 7750.1 U5.1
N$68
  Bottom 0.813: U5.2 7751.1
N$69
  Bottom 0.813: U5.3 7752.1
N$70
  Bottom 0.813: U5.4 7753.1
N$71
  Bottom 0.813: U5.5 7754.1
N$72
  Bottom 0.813: 7755.1 U5.6
N$73
  Bottom 0.813: U5.7 7756.1
N$74
  Bottom 0.813: U5.9 7757.1
N$76
  Bottom 0.813: U7.1 7760.1
N$77
  Bottom 0.813: U7.2 7761.1
N$78
  Bottom 0.813: 7762.1 U7.3
N$79
  Bottom 0.813: 7763.1 U7.4
N$80
  Bottom 0.813: 7764.1 U7.5
N$81
  Bottom 0.813: 7765.1 U7.6
N$82
  Bottom 0.813: 7766.1 U7.7
N$83
  Bottom 0.813: 7767.1 U7.9
N$85
  Bottom 0.813: U9.1 7770.1
N$86
  Bottom 0.813: 7771.1 U9.2
N$87
  Bottom 0.813: U9.3 7772.1
N$88
  Bottom 0.813: 7773.1 U9.4
N$89
  Bottom 0.813: 7774.1 U9.5
N$90
  Bottom 0.813: 7775.1 U9.6
N$91
  Bottom 0.813: U9.7 7776.1
N$92
  Bottom 0.813: U9.9 7777.1
VCC  (via drill 0.81)
  Top 0.813: U4.8 187.83,73.66 arc-12 R1.2 | U3.16 162.43,134.62 | 162.43,134.62 166.24,134.62 | U1.16 218.31,134.62 | 218.31,134.62 v186.56,134.62 166.24,134.62 | 166.24,134.62 BYP2.1 | BYP1.1 218.31,134.62 | U9.16 40.51,134.62 | 40.51,134.62 81.15,134.62 | 81.15,134.62 U7.16 | BYP5.1 84.96,134.62 | 84.96,134.62 121.79,134.62 | 121.79,134.62 125.6,134.62 | 125.6,134.62 162.43,134.62 | U5.16 121.79,134.62 | BYP3.1 125.6,134.62 | BYP7.1 22.73,134.62 40.51,134.62 | U2.14 arc90 199.26,104.14 82.42,104.14 U8.16 | U10.8 53.21,76.2 arc19 76.07,66.04 149.73,63.5 206.88,63.5 arc90 R4.2 | R2.2 arc-90 203.07,64.77 154.81,64.77 arc-62 U6.8 | 84.96,134.62 81.15,134.62
  PWR 0.813: U7.16 79.88,129.54 79.88,101.6 U8.16
  Bottom 0.813: v186.56,134.62 186.56,171.45 arc37 182.75,182.88 arc33 172.59,190.5 arc4 164.97,193.04 arc10 152.27,195.58 arc5 R6.2 | U$2.BA2 191.64,8.26 191.64,15.24 arc-11 195.45,53.34 197.99,66.04 | 197.99,66.04 199.26,81.28 arc9 201.8,96.52 U2.14 | U$2.AA2 261.49,8.26 261.49,15.24 arc18 256.41,60.96 arc17 243.71,93.98 BYP1.1 | R5.2 R4.2 R3.2 R2.2 R1.2 197.99,66.04 | BYP4.1 U6.8 | BYP6.1 79.88,81.28 arc-18 79.88,93.98 arc-42 U8.16 | BYP8.1 U10.8

### Text on the board
Top: OFF | ON | 104-DE-8 | BOOT MEMORY PROTECT BOARD | DOUGLAS ELECTRONICS, INC. | REV. 1 | FIELD | 7777 | 7776 | 7775 | 7774 | 7773 | 7772 | 7771 | 7770 | 7767 | 7766 | 7765 | 7764 | 7763 | 7762 | 7761 | 7760 | 7757 | 7756 | 7755 | 7754 | 7753 | 7752 | 7751 | 7750 | 7747 | 7746 | 7745 | 7744 | 7743 | 7742 | 7741 | 7740 | 7 | 6 | 5 | 4 | 3 | 2 | 1 | 0
Document: Omit PWR plane!
201bmp: C:/Users/Vince/Documents/eagle/projects/DEC/DouglasElectronics/img11222018_108b.bmp